# Altium schematic sheet OSCILLAR_HFB_V1p0_SPLIT.SchDoc
size A4; SheetNumber: 4; SheetTotal: 15; Title_: Digital Clocks
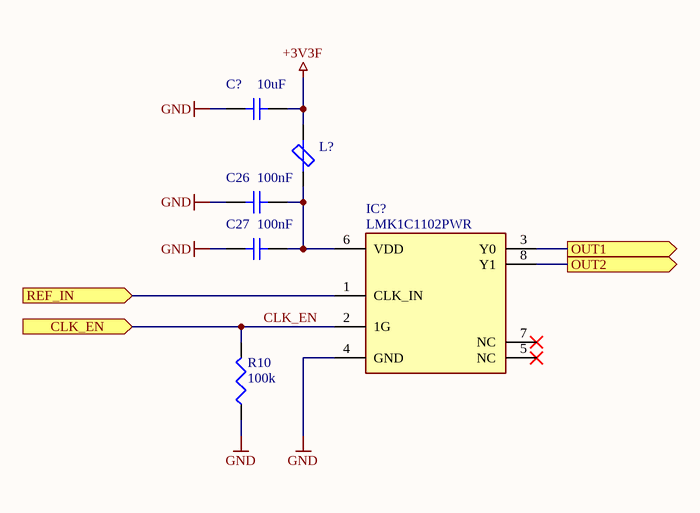
[diagram p0: OSCILLAR_HFB_V1p0_SPLIT.SchDoc]

## Parts
C26  100nF  [CAP-0805]
C27  100nF  [CAP-0805]
C?  10uF  [CAP_0603]
IC?  LMK1C1102PWR  [TSSOP8]
L?  1000R  [IND-0805-EMI]  (value not drawn)
R10  100k  [RES-0805]

## Ports
CLK_EN (in, see OSCILLAR_HFB_V1p0_MAIN), OUT1 (out, see OSCILLAR_HFB_V1p0_MAIN), OUT2 (out, see OSCILLAR_HFB_V1p0_MAIN), REF_IN (in, see OSCILLAR_HFB_V1p0_MAIN)

## Nets
+3V3F: C?.2 L?.2
GND: C26.2 C27.2 C?.1 IC?.4(GND) R10.1
CLK_EN: IC?.2(1G) R10.2 ; port CLK_EN
OUT1: IC?.3(Y0) ; port OUT1
OUT2: IC?.8(Y1) ; port OUT2
REF_IN: IC?.1(CLK_IN) ; port REF_IN
NetC26_1: C26.1 C27.1 IC?.6(VDD) L?.1

Not connected (* = marked no-connect by the designer): IC? 5(NC)* 7(NC)*

## Notes on the sheet
- Board:
- Author:
- Title:
- Project:
- SVN:
- Version:
- Sheet:
- of
- Contact:
- Modified:
- Size:
- A4

## Library data of the parts
C26 C27 C? = NP-CAPACITOR: MLCC capacitor; Type: CAP
IC? = LMK1C1102PWR: Clock Buffer 2-channel output LVCMOS 1.8-V buffer; Part number: 595-LMK1C1102PWR; Type: IC; Supplier: Mouser; ComponentLink1Description: Datasheet; ComponentLink1URL: lmk1c1102.pdf; ComponentLink2Description: Order; ComponentLink2URL: https://hu.mouser.com/ProductDetail/Texas-Instruments/LMK1C1102PWR?qs=rI7uf1IzohQAH976VttrBg%3D%3D
L? = BLM21SP102SN1D: Chip Ferrite Bead, 1000R @100MHz, 1.6A; Part number: 81-BLM21SP102SN1D; Type: IND; Supplier: Mouser; ComponentLink1Description: Datasheet; ComponentLink1URL: ENFA0005-1915781.pdf; ComponentLink2Description: Order; ComponentLink2URL: https://hu.mouser.com/ProductDetail/Murata-Electronics/BLM21SP102SN1D?qs=17u8i%2FzlE88oj6hmj%252BXptA%3D%3D
R10 = RESISTOR: Metal Film Resistor; Type: RES